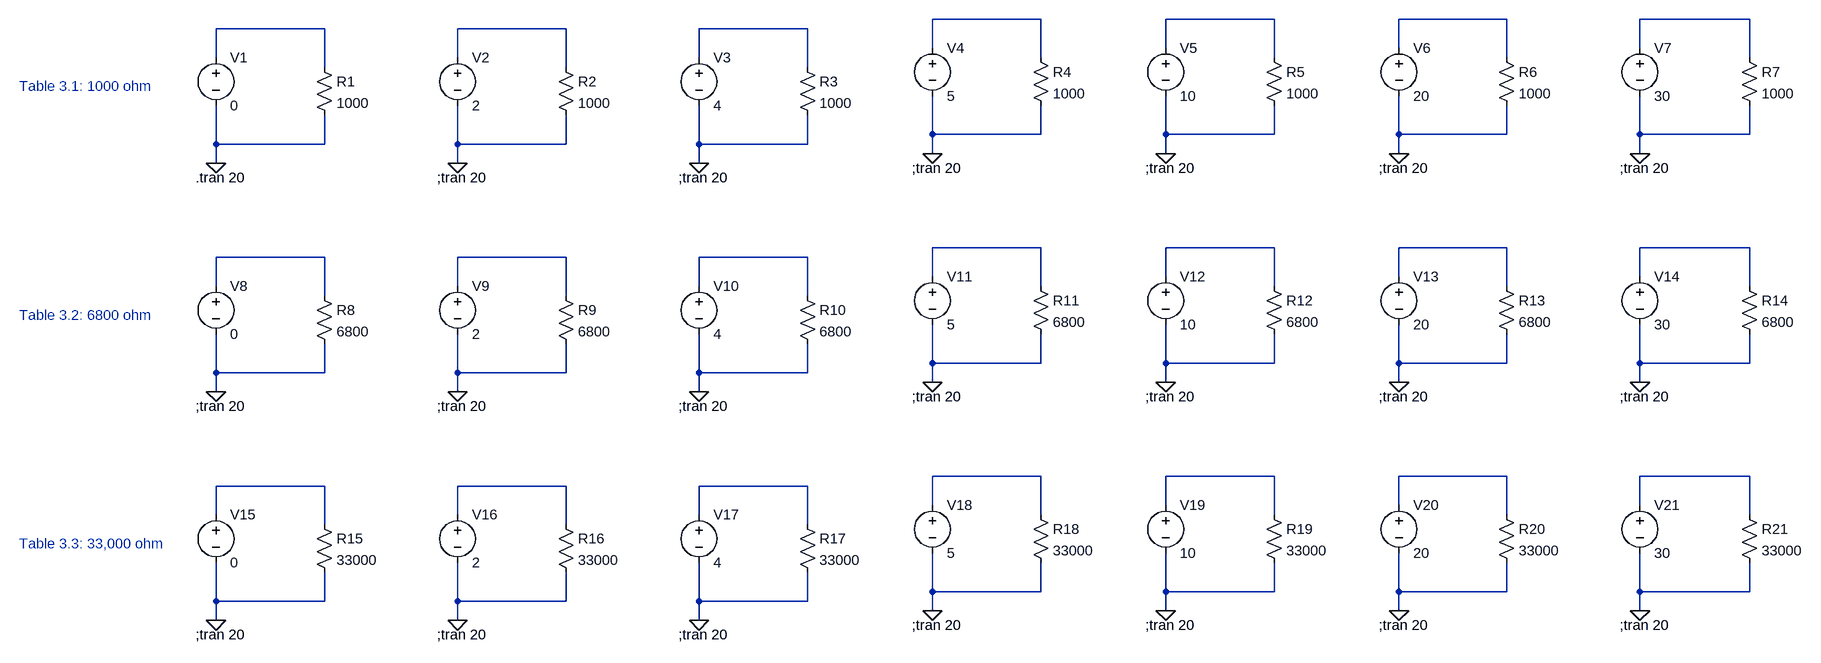
[diagram p0: schematic LAB_003_Tonino_Kent_Louise.asc]
LAB_003_Tonino_Kent_Louise.asc, the LTspice schematic file:
Version 4
SHEET 1 3084 1128
WIRE 1584 16 1328 16
WIRE 2048 16 1792 16
WIRE 2512 16 2256 16
WIRE 2992 16 2736 16
WIRE 128 32 -128 32
WIRE 624 32 368 32
WIRE 1120 32 864 32
WIRE 1328 64 1328 16
WIRE 1792 64 1792 16
WIRE 2256 64 2256 16
WIRE 2736 64 2736 16
WIRE -128 80 -128 32
WIRE 368 80 368 32
WIRE 864 80 864 32
WIRE 1584 80 1584 16
WIRE 2048 80 2048 16
WIRE 2512 80 2512 16
WIRE 2992 80 2992 16
WIRE 128 96 128 32
WIRE 624 96 624 32
WIRE 1120 96 1120 32
WIRE 1328 208 1328 144
WIRE 1584 208 1584 160
WIRE 1584 208 1328 208
WIRE 1792 208 1792 144
WIRE 2048 208 2048 160
WIRE 2048 208 1792 208
WIRE 2256 208 2256 144
WIRE 2512 208 2512 160
WIRE 2512 208 2256 208
WIRE 2736 208 2736 144
WIRE 2992 208 2992 160
WIRE 2992 208 2736 208
WIRE -128 224 -128 160
WIRE 128 224 128 176
WIRE 128 224 -128 224
WIRE 368 224 368 160
WIRE 624 224 624 176
WIRE 624 224 368 224
WIRE 864 224 864 160
WIRE 1120 224 1120 176
WIRE 1120 224 864 224
WIRE 1328 240 1328 208
WIRE 1792 240 1792 208
WIRE 2256 240 2256 208
WIRE 2736 240 2736 208
WIRE -128 256 -128 224
WIRE 368 256 368 224
WIRE 864 256 864 224
WIRE 1584 432 1328 432
WIRE 2048 432 1792 432
WIRE 2512 432 2256 432
WIRE 2992 432 2736 432
WIRE 128 448 -128 448
WIRE 624 448 368 448
WIRE 1120 448 864 448
WIRE 1328 480 1328 432
WIRE 1792 480 1792 432
WIRE 2256 480 2256 432
WIRE 2736 480 2736 432
WIRE -128 496 -128 448
WIRE 368 496 368 448
WIRE 864 496 864 448
WIRE 1584 496 1584 432
WIRE 2048 496 2048 432
WIRE 2512 496 2512 432
WIRE 2992 496 2992 432
WIRE 128 512 128 448
WIRE 624 512 624 448
WIRE 1120 512 1120 448
WIRE 1328 624 1328 560
WIRE 1584 624 1584 576
WIRE 1584 624 1328 624
WIRE 1792 624 1792 560
WIRE 2048 624 2048 576
WIRE 2048 624 1792 624
WIRE 2256 624 2256 560
WIRE 2512 624 2512 576
WIRE 2512 624 2256 624
WIRE 2736 624 2736 560
WIRE 2992 624 2992 576
WIRE 2992 624 2736 624
WIRE -128 640 -128 576
WIRE 128 640 128 592
WIRE 128 640 -128 640
WIRE 368 640 368 576
WIRE 624 640 624 592
WIRE 624 640 368 640
WIRE 864 640 864 576
WIRE 1120 640 1120 592
WIRE 1120 640 864 640
WIRE 1328 656 1328 624
WIRE 1792 656 1792 624
WIRE 2256 656 2256 624
WIRE 2736 656 2736 624
WIRE -128 672 -128 640
WIRE 368 672 368 640
WIRE 864 672 864 640
WIRE 1584 848 1328 848
WIRE 2048 848 1792 848
WIRE 2512 848 2256 848
WIRE 2992 848 2736 848
WIRE 128 864 -128 864
WIRE 624 864 368 864
WIRE 1120 864 864 864
WIRE 1328 896 1328 848
WIRE 1792 896 1792 848
WIRE 2256 896 2256 848
WIRE 2736 896 2736 848
WIRE -128 912 -128 864
WIRE 368 912 368 864
WIRE 864 912 864 864
WIRE 1584 912 1584 848
WIRE 2048 912 2048 848
WIRE 2512 912 2512 848
WIRE 2992 912 2992 848
WIRE 128 928 128 864
WIRE 624 928 624 864
WIRE 1120 928 1120 864
WIRE 1328 1040 1328 976
WIRE 1584 1040 1584 992
WIRE 1584 1040 1328 1040
WIRE 1792 1040 1792 976
WIRE 2048 1040 2048 992
WIRE 2048 1040 1792 1040
WIRE 2256 1040 2256 976
WIRE 2512 1040 2512 992
WIRE 2512 1040 2256 1040
WIRE 2736 1040 2736 976
WIRE 2992 1040 2992 992
WIRE 2992 1040 2736 1040
WIRE -128 1056 -128 992
WIRE 128 1056 128 1008
WIRE 128 1056 -128 1056
WIRE 368 1056 368 992
WIRE 624 1056 624 1008
WIRE 624 1056 368 1056
WIRE 864 1056 864 992
WIRE 1120 1056 1120 1008
WIRE 1120 1056 864 1056
WIRE 1328 1072 1328 1040
WIRE 1792 1072 1792 1040
WIRE 2256 1072 2256 1040
WIRE 2736 1072 2736 1040
WIRE -128 1088 -128 1056
WIRE 368 1088 368 1056
WIRE 864 1088 864 1056
FLAG -128 256 0
FLAG 368 256 0
FLAG 864 256 0
FLAG 1328 240 0
FLAG 1792 240 0
FLAG 2256 240 0
FLAG 2736 240 0
FLAG -128 672 0
FLAG 368 672 0
FLAG 864 672 0
FLAG 1328 656 0
FLAG 1792 656 0
FLAG 2256 656 0
FLAG 2736 656 0
FLAG -128 1088 0
FLAG 368 1088 0
FLAG 864 1088 0
FLAG 1328 1072 0
FLAG 1792 1072 0
FLAG 2256 1072 0
FLAG 2736 1072 0
SYMBOL res 112 80 R0
SYMATTR InstName R1
SYMATTR Value 1000
SYMBOL voltage -128 64 R0
WINDOW 123 0 0 Left 0
WINDOW 39 0 0 Left 0
SYMATTR InstName V1
SYMATTR Value 0
SYMBOL res 608 80 R0
SYMATTR InstName R2
SYMATTR Value 1000
SYMBOL voltage 368 64 R0
WINDOW 123 0 0 Left 0
WINDOW 39 0 0 Left 0
SYMATTR InstName V2
SYMATTR Value 2
SYMBOL res 1104 80 R0
SYMATTR InstName R3
SYMATTR Value 1000
SYMBOL voltage 864 64 R0
WINDOW 123 0 0 Left 0
WINDOW 39 0 0 Left 0
SYMATTR InstName V3
SYMATTR Value 4
SYMBOL res 1568 64 R0
SYMATTR InstName R4
SYMATTR Value 1000
SYMBOL voltage 1328 48 R0
WINDOW 123 0 0 Left 0
WINDOW 39 0 0 Left 0
SYMATTR InstName V4
SYMATTR Value 5
SYMBOL res 2032 64 R0
SYMATTR InstName R5
SYMATTR Value 1000
SYMBOL voltage 1792 48 R0
WINDOW 123 0 0 Left 0
WINDOW 39 0 0 Left 0
SYMATTR InstName V5
SYMATTR Value 10
SYMBOL res 2496 64 R0
SYMATTR InstName R6
SYMATTR Value 1000
SYMBOL voltage 2256 48 R0
WINDOW 123 0 0 Left 0
WINDOW 39 0 0 Left 0
SYMATTR InstName V6
SYMATTR Value 20
SYMBOL res 2976 64 R0
SYMATTR InstName R7
SYMATTR Value 1000
SYMBOL voltage 2736 48 R0
WINDOW 123 0 0 Left 0
WINDOW 39 0 0 Left 0
SYMATTR InstName V7
SYMATTR Value 30
SYMBOL res 112 496 R0
SYMATTR InstName R8
SYMATTR Value 6800
SYMBOL voltage -128 480 R0
WINDOW 123 0 0 Left 0
WINDOW 39 0 0 Left 0
SYMATTR InstName V8
SYMATTR Value 0
SYMBOL res 608 496 R0
SYMATTR InstName R9
SYMATTR Value 6800
SYMBOL voltage 368 480 R0
WINDOW 123 0 0 Left 0
WINDOW 39 0 0 Left 0
SYMATTR InstName V9
SYMATTR Value 2
SYMBOL res 1104 496 R0
SYMATTR InstName R10
SYMATTR Value 6800
SYMBOL voltage 864 480 R0
WINDOW 123 0 0 Left 0
WINDOW 39 0 0 Left 0
SYMATTR InstName V10
SYMATTR Value 4
SYMBOL res 1568 480 R0
SYMATTR InstName R11
SYMATTR Value 6800
SYMBOL voltage 1328 464 R0
WINDOW 123 0 0 Left 0
WINDOW 39 0 0 Left 0
SYMATTR InstName V11
SYMATTR Value 5
SYMBOL res 2032 480 R0
SYMATTR InstName R12
SYMATTR Value 6800
SYMBOL voltage 1792 464 R0
WINDOW 123 0 0 Left 0
WINDOW 39 0 0 Left 0
SYMATTR InstName V12
SYMATTR Value 10
SYMBOL res 2496 480 R0
SYMATTR InstName R13
SYMATTR Value 6800
SYMBOL voltage 2256 464 R0
WINDOW 123 0 0 Left 0
WINDOW 39 0 0 Left 0
SYMATTR InstName V13
SYMATTR Value 20
SYMBOL res 2976 480 R0
SYMATTR InstName R14
SYMATTR Value 6800
SYMBOL voltage 2736 464 R0
WINDOW 123 0 0 Left 0
WINDOW 39 0 0 Left 0
SYMATTR InstName V14
SYMATTR Value 30
SYMBOL res 112 912 R0
SYMATTR InstName R15
SYMATTR Value 33000
SYMBOL voltage -128 896 R0
WINDOW 123 0 0 Left 0
WINDOW 39 0 0 Left 0
SYMATTR InstName V15
SYMATTR Value 0
SYMBOL res 608 912 R0
SYMATTR InstName R16
SYMATTR Value 33000
SYMBOL voltage 368 896 R0
WINDOW 123 0 0 Left 0
WINDOW 39 0 0 Left 0
SYMATTR InstName V16
SYMATTR Value 2
SYMBOL res 1104 912 R0
SYMATTR InstName R17
SYMATTR Value 33000
SYMBOL voltage 864 896 R0
WINDOW 123 0 0 Left 0
WINDOW 39 0 0 Left 0
SYMATTR InstName V17
SYMATTR Value 4
SYMBOL res 1568 896 R0
SYMATTR InstName R18
SYMATTR Value 33000
SYMBOL voltage 1328 880 R0
WINDOW 123 0 0 Left 0
WINDOW 39 0 0 Left 0
SYMATTR InstName V18
SYMATTR Value 5
SYMBOL res 2032 896 R0
SYMATTR InstName R19
SYMATTR Value 33000
SYMBOL voltage 1792 880 R0
WINDOW 123 0 0 Left 0
WINDOW 39 0 0 Left 0
SYMATTR InstName V19
SYMATTR Value 10
SYMBOL res 2496 896 R0
SYMATTR InstName R20
SYMATTR Value 33000
SYMBOL voltage 2256 880 R0
WINDOW 123 0 0 Left 0
WINDOW 39 0 0 Left 0
SYMATTR InstName V20
SYMATTR Value 20
SYMBOL res 2976 896 R0
SYMATTR InstName R21
SYMATTR Value 33000
SYMBOL voltage 2736 880 R0
WINDOW 123 0 0 Left 0
WINDOW 39 0 0 Left 0
SYMATTR InstName V21
SYMATTR Value 30
TEXT -162 280 Left 2 !.tran 20
TEXT 334 280 Left 2 !;tran 20
TEXT 830 280 Left 2 !;tran 20
TEXT 1294 264 Left 2 !;tran 20
TEXT 1758 264 Left 2 !;tran 20
TEXT 2222 264 Left 2 !;tran 20
TEXT 2702 264 Left 2 !;tran 20
TEXT -456 128 Left 2 ;Table 3.1: 1000 ohm
TEXT -162 696 Left 2 !;tran 20
TEXT 334 696 Left 2 !;tran 20
TEXT 830 696 Left 2 !;tran 20
TEXT 1294 680 Left 2 !;tran 20
TEXT 1758 680 Left 2 !;tran 20
TEXT 2222 680 Left 2 !;tran 20
TEXT 2702 680 Left 2 !;tran 20
TEXT -456 544 Left 2 ;Table 3.2: 6800 ohm
TEXT -162 1112 Left 2 !;tran 20
TEXT 334 1112 Left 2 !;tran 20
TEXT 830 1112 Left 2 !;tran 20
TEXT 1294 1096 Left 2 !;tran 20
TEXT 1758 1096 Left 2 !;tran 20
TEXT 2222 1096 Left 2 !;tran 20
TEXT 2702 1096 Left 2 !;tran 20
TEXT -456 960 Left 2 ;Table 3.3: 33,000 ohm

The netlist it stands for:
* LAB_003_Tonino_Kent_Louise.asc
R1 N005 0 1000
V1 N005 0 0
R2 N006 0 1000
V2 N006 0 2
R3 N007 0 1000
V3 N007 0 4
R4 N001 0 1000
V4 N001 0 5
R5 N002 0 1000
V5 N002 0 10
R6 N003 0 1000
V6 N003 0 20
R7 N004 0 1000
V7 N004 0 30
R8 N012 0 6800
V8 N012 0 0
R9 N013 0 6800
V9 N013 0 2
R10 N014 0 6800
V10 N014 0 4
R11 N008 0 6800
V11 N008 0 5
R12 N009 0 6800
V12 N009 0 10
R13 N010 0 6800
V13 N010 0 20
R14 N011 0 6800
V14 N011 0 30
R15 N019 0 33000
V15 N019 0 0
R16 N020 0 33000
V16 N020 0 2
R17 N021 0 33000
V17 N021 0 4
R18 N015 0 33000
V18 N015 0 5
R19 N016 0 33000
V19 N016 0 10
R20 N017 0 33000
V20 N017 0 20
R21 N018 0 33000
V21 N018 0 30
.tran 20
;tran 20
;tran 20
;tran 20
;tran 20
;tran 20
;tran 20
* Table 3.1: 1000 ohm
;tran 20
;tran 20
;tran 20
;tran 20
;tran 20
;tran 20
;tran 20
* Table 3.2: 6800 ohm
;tran 20
;tran 20
;tran 20
;tran 20
;tran 20
;tran 20
;tran 20
* Table 3.3: 33,000 ohm
.backanno
.end